# Altium schematic sheet main.SchDoc
size A3
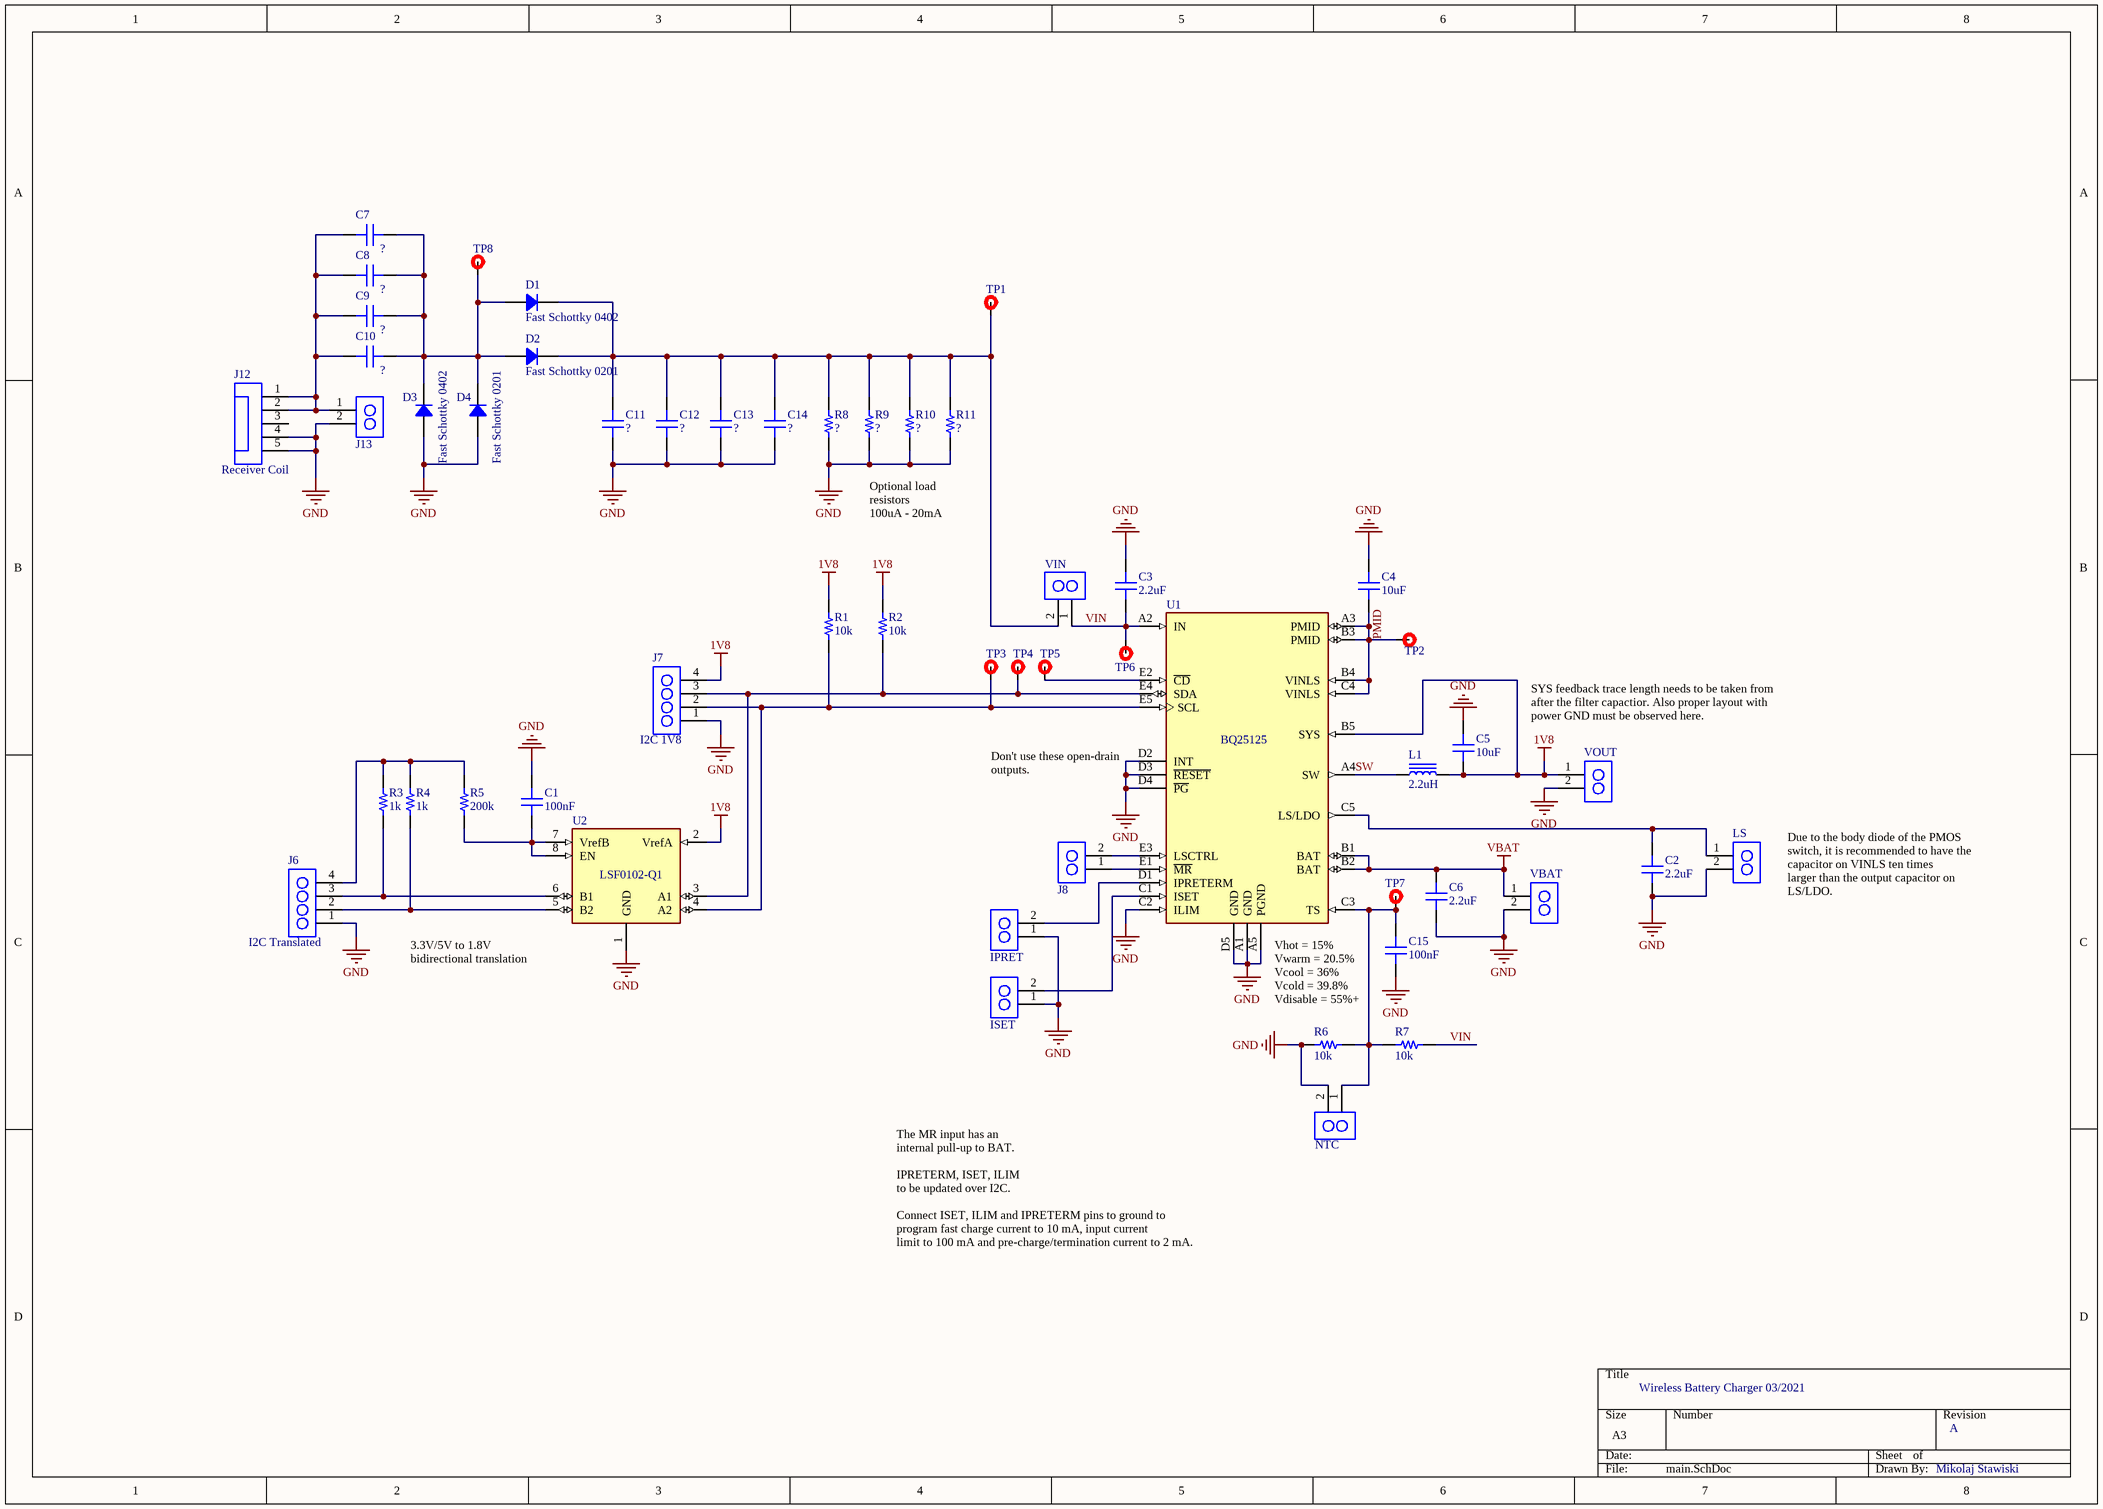
[diagram p0: main.SchDoc]

## Parts
C1  100nF  [SMD_CAPACITOR_0603]
C2  2.2uF  [SMD_CAPACITOR_0402]
C3  2.2uF  [SMD_CAPACITOR_0402]
C4  10uF  [SMD_CAPACITOR_0402]
C5  10uF  [SMD_CAPACITOR_0402]
C6  2.2uF  [SMD_CAPACITOR_0402]
C7  ?  [SMD_CAPACITOR_0402]
C8  ?  [SMD_CAPACITOR_0402]
C9  ?  [SMD_CAPACITOR_0402]
C10  ?  [SMD_CAPACITOR_0402]
C11  ?  [SMD_CAPACITOR_0402]
C12  ?  [SMD_CAPACITOR_0402]
C13  ?  [SMD_CAPACITOR_0402]
C14  ?  [SMD_CAPACITOR_0402]
C15  100nF  [SMD_CAPACITOR_0201]
D1  Fast Schottky 0402  [CLP1006-2L]
D2  Fast Schottky 0201  [CLP0603-2M]
D3  Fast Schottky 0402  [CLP1006-2L]
D4  Fast Schottky 0201  [CLP0603-2M]
IPRET  *  [HEADER_2PIN_0022272021]  (value not drawn)
ISET  *  [HEADER_2PIN_0022272021]  (value not drawn)
J6  I2C Translated  [HEADER_4PIN_0022272041]
J7  I2C 1V8  [HEADER_4PIN_0022272041]
J8  *  [HEADER_2PIN_0022272021]  (value not drawn)
J12  Receiver Coil  [FPC_5PIN_0545500571]
J13  *  [HEADER_2PIN_0022272021]  (value not drawn)
L1  2.2uH  [SMD_INDUCTOR_0603]
LS  LOAD SWITCH  [HEADER_2PIN_0022272021]  (value not drawn)
NTC  NTC  [HEADER_2PIN_0022272021]  (value not drawn)
R1  10k  [SMD_RESISTOR_0603]
R2  10k  [SMD_RESISTOR_0603]
R3  1k  [SMD_RESISTOR_0603]
R4  1k  [SMD_RESISTOR_0603]
R5  200k  [SMD_RESISTOR_0603]
R6  10k  [SMD_RESISTOR_0603]
R7  10k  [SMD_RESISTOR_0603]
R8  ?  [SMD_RESISTOR_0603]
R9  ?  [SMD_RESISTOR_0603]
R10  ?  [SMD_RESISTOR_0402]
R11  ?  [SMD_RESISTOR_0402]
TP1  Testpoint  [Testpoint 2mm]  (value not drawn)
TP2  Testpoint  [Testpoint 2mm]  (value not drawn)
TP3  Testpoint  [Testpoint 2mm]  (value not drawn)
TP4  Testpoint  [Testpoint 2mm]  (value not drawn)
TP5  Testpoint  [Testpoint 2mm]  (value not drawn)
TP6  Testpoint  [Testpoint 2mm]  (value not drawn)
TP7  Testpoint  [Testpoint 2mm]  (value not drawn)
TP8  Testpoint  [Testpoint 2mm]  (value not drawn)
U1  BQ25125  [BQ25125-DSBGA25]
U2  LSF0102-Q1  [8-VSSOP]
VBAT  BATTERY  [HEADER_2PIN_0022272021]  (value not drawn)
VIN  *  [HEADER_2PIN_0022272021]  (value not drawn)
VOUT  OUT  [HEADER_2PIN_0022272021]  (value not drawn)

## Nets
1V8: C5.1 J7.4 L1.2 R1.2 R2.2 U1.B5(SYS) U2.2(VrefA) VOUT.1
GND: C1.2 C2.1 C3.2 C4.2 C5.2 C6.1 C11.1 C12.1 C13.1 C14.1 C15.1 D3.1 D4.1 IPRET.1 ISET.1 J6.1 J7.1 J12.4 J12.5 J13.2 LS.2 NTC.2 R6.2 R8.1 R9.1 R10.1 R11.1 U1.A1(GND) U1.A5(PGND) U1.C2(ILIM) U1.D2(INT) U1.D3(~{RESET}) U1.D4(~{PG}) U1.D5(GND) U2.1(GND) VBAT.2 VOUT.2
VBAT: C6.2 U1.B1(BAT) U1.B2(BAT) VBAT.1
PMID: C4.1 TP2.1 U1.A3(PMID) U1.B3(PMID) U1.B4(VINLS) U1.C4(VINLS)
SW: L1.1 U1.A4(SW)
VIN: C3.1 R7.1 TP6.1 U1.A2(IN) VIN.1
NetC1_1: C1.1 R5.1 U2.7(VrefB) U2.8(EN)
NetC2_2: C2.2 LS.1 U1.C5(LS/LDO)
NetC7_1: C7.1 C8.1 C9.1 C10.1 D1.1 D2.1 D3.2 D4.2 TP8.1
NetC7_2: C7.2 C8.2 C9.2 C10.2 J12.1 J12.2 J13.1
NetC11_2: C11.2 C12.2 C13.2 C14.2 D1.2 D2.2 R8.2 R9.2 R10.2 R11.2 TP1.1 VIN.2
NetC15_2: C15.2 NTC.1 R6.1 R7.2 TP7.1 U1.C3(TS)
NetIPRET_2: IPRET.2 U1.D1(IPRETERM)
NetISET_2: ISET.2 U1.C1(ISET)
NetJ6_2: J6.2 R4.1 U2.5(B2)
NetJ6_3: J6.3 R3.1 U2.6(B1)
NetJ6_4: J6.4 R3.2 R4.2 R5.2
NetJ7_2: J7.2 R1.1 TP3.1 U1.E5(SCL) U2.4(A2)
NetJ7_3: J7.3 R2.1 TP4.1 U1.E4(SDA) U2.3(A1)
NetJ8_1: J8.1 U1.E1(~{MR})
NetJ8_2: J8.2 U1.E3(LSCTRL)
NetTP5_1: TP5.1 U1.E2(~{CD})

Not connected (* = marked no-connect by the designer): J12 3

## Notes on the sheet
- Optional load resistors
  100uA - 20mA
- SYS feedback trace length needs to be taken from after the filter capactior. Also proper layout with power GND must be observed here.
- (near U1) Don't use these open-drain outputs.
- Due to the body diode of the PMOS switch, it is recommended to have the capacitor on VINLS ten times
  larger than the output capacitor on LS/LDO.
- (near U2) 3.3V/5V to 1.8V bidirectional translation
- (near U1) Vhot = 15%
  Vwarm = 20.5%
  Vcool = 36%
  Vcold = 39.8%
  Vdisable = 55%+
- IPRETERM, ISET, ILIM to be updated over I2C.
- The MR input has an internal pull-up to BAT.
- Connect ISET, ILIM and IPRETERM pins to ground to program fast charge current to 10 mA, input current
  limit to 100 mA and pre-charge/termination current to 2 mA.
- Wireless Battery Charger 03/2021
- A
- Mikolaj Stawiski

## Library data of the parts
C1 = CAPACITOR_0603: Capacitor SMT 0603; Part Number: *; Value: 100nF; Device Package: 0603 (1608 Metric); Manufacturer: *; Mounting Type: SMT; Operating Temperature: *; Size / Dimension: 0.063" L x 0.031" W (1.60mm x 0.80mm); Thickness (Max): *; Tolerance: *; Voltage - Rated: *; Distributor link 1: *; Distributor link 2: *; Distributor link 3: *
C2 C3 C6 = CAPACITOR_0402: Ceramic Capacitor 2.2uF 20% 6.3V X5R 0402; Part Number: GRM155R60J225ME15D; Manufacturer: Murata; Value: 2.2uF; Device Package: 0402 (1005 Metric); Mounting Type: SMT; Operating Temperature: *; Size / Dimension: 0.039" L x 0.020" W (1.00mm x 0.50mm); Thickness (Max): *; Tolerance: 20%; Voltage - Rated: 6.3V; Distributor link 1: https://www.digikey.com.au/product-detail/en/murata-electronics/GRM155R60J225ME15D/490-4519-1-ND/1033278; Distributor link 2: *; Distributor link 3: *
C4 C5 = CAPACITOR_0402: Ceramic Capacitor 10uF 20% 10V X5R 0402; Part Number: CL05A106MP5NUNC; Manufacturer: Samsung; Value: 10uF; Device Package: 0402 (1005 Metric); Mounting Type: SMT; Operating Temperature: *; Size / Dimension: 0.039" L x 0.020" W (1.00mm x 0.50mm); Thickness (Max): *; Tolerance: 20%; Voltage - Rated: 10V; Distributor link 1: https://www.digikey.com/en/products/detail/samsung-electro-mechanics/CL05A106MP5NUNC/3887108?s=N4IgTCBcDaIMIBkAMBWAggRiQNgLIAUUA5AVSLhAF0BfIA; Distributor link 2: *; Distributor link 3: *
C7-C14 = CAPACITOR_0402: Ceramic Capacitor 10V X5R 0402; Part Number: ?; Value: ?; Device Package: 0402 (1005 Metric); Manufacturer: ?; Mounting Type: SMT; Operating Temperature: *; Size / Dimension: 0.039" L x 0.020" W (1.00mm x 0.50mm); Thickness (Max): *; Tolerance: *; Voltage - Rated: 10V; Distributor link 1: *; Distributor link 2: *; Distributor link 3: *
C15 = CAPACITOR_0201: Capacitor SMT 0201; Part Number: *; Value: 100nF; Device Package: 0201 (0603 Metric); Manufacturer: *; Mounting Type: SMT; Operating Temperature: *; Size / Dimension: 0.024" L x 0.012" W (0.60mm x 0.30mm); Thickness (Max): *; Tolerance: *; Voltage - Rated: *; Distributor link 1: *; Distributor link 2: *; Distributor link 3: *
D1 D3 = DIODE_0402: Diode SMT 0402; Part Number: VSKY05301006; Manufacturer: Vishay; Value: Fast Schottky 0402; Device Package: 0402 (1005 Metric); Mounting Type: SMT; Operating Temperature: *; Size / Dimension: 0.039" L x 0.020" W (1.00mm x 0.50mm); Thickness (Max): *; Tolerance: *; Voltage - Rated: *; Distributor link 1: https://www.digikey.com/en/products/detail/vishay-general-semiconductor-diodes-division/VSKY05301006-G4-08/7390852; Distributor link 2: *; Distributor link 3: *
D2 D4 = DIODE_0201: Diode SMT 0201; Part Number: VSKY02300603; Manufacturer: Vishay; Value: Fast Schottky 0201; Device Package: 0201 (0603 Metric); Mounting Type: SMT; Operating Temperature: *; Size / Dimension: 0.024" L x 0.012" W (0.60mm x 0.30mm); Thickness (Max): *; Tolerance: *; Voltage - Rated: *; Distributor link 1: https://www.digikey.com/en/products/detail/vishay-general-semiconductor-diodes-division/VSKY02300603-G4-08/7390849; Distributor link 2: *; Distributor link 3: *
IPRET ISET J8 J13 LS NTC VBAT VIN VOUT = CONN_2PIN: Connector 2-pin generic; Part Number: *; Value: *; Device Package: *; Manufacturer: *; Mounting Type: *; Operating Temperature: *; Size / Dimension: *; Thickness (Max): *; Voltage - Rated: *; Distributor link 1: *; Distributor link 2: *; Distributor link 3: *
J6 J7 = CONN_4PIN: Connector 4-pin generic; Part Number: *; Value: *; Device Package: *; Manufacturer: *; Mounting Type: *; Operating Temperature: *; Size / Dimension: *; Thickness (Max): *; Voltage - Rated: *; Distributor link 1: *; Distributor link 2: *; Distributor link 3: *
J12 = CONN_FPC_5PIN: FPC connector 5-pin generic; Part Number: *; Value: Receiver Coil; Device Package: *; Manufacturer: *; Mounting Type: *; Operating Temperature: *; Size / Dimension: *; Thickness (Max): *; Voltage - Rated: *; Distributor link 1: *; Distributor link 2: *; Distributor link 3: *
L1 = INDUCTOR_0603: Inductor fixed 2.2uH 20% 500mA 180mOhm 0603; Part Number: MLZ1608N2R2LT000; Manufacturer: TDK; Value: 2.2uH; Device Package: 0603 (1608 Metric); Mounting Type: SMT; Operating Temperature: *; Size / Dimension: 0.063" L x 0.031" W (1.60mm x 0.80mm); Thickness (Max): *; Tolerance: 20%; Voltage - Rated: *; Distributor link 1: https://www.digikey.com.au/product-detail/en/tdk-corporation/MLZ1608N2R2LT000/445-6754-1-ND/2523575; Distributor link 2: *; Distributor link 3: *
R1-R9 = RESISTOR_0603: Resistor SMT 0603; Part Number: *; Device Package: 0603 (1608 Metric); Manufacturer: *; Mounting Type: SMT; Operating Temperature: *; Size / Dimension: 0.063" L x 0.031" W (1.60mm x 0.80mm); Thickness (Max): *; Tolerance: *; Voltage - Rated: *; Distributor link 1: *; Distributor link 2: *; Distributor link 3: *
  R1 R2 R6 R7: Value: 10k
  R3 R4: Value: 1k
  R5: Value: 200k
  R8 R9: Value: ?
R10 R11 = RESISTOR_0402: Resistor SMT 0402; Part Number: *; Value: ?; Device Package: 0402 (1005 Metric); Manufacturer: *; Mounting Type: SMT; Operating Temperature: *; Size / Dimension: 0.039" L x 0.020" W (1.00mm x 0.50mm); Thickness (Max): *; Tolerance: *; Voltage - Rated: *; Distributor link 1: *; Distributor link 2: *; Distributor link 3: *
TP1-TP8 = Testpoint: Testpoint for measuring at the PCB
U1 = BQ25125: BQ25125 Low IQ Highly Integrated Battery Charge Management Solution For Wearables and IoT; Manufacturer: TI; Part Number: BQ25125; Value: BQ25125; Device Package: *; Mounting Type: SMT; Operating Temperature: *; Package / Case: *; Size / Dimension: *; Thickness (Max): *; Distributor link 1: https://www.digikey.com/en/products/detail/texas-instruments/BQ25125YFPR/10273214; Distributor link 2: *; Distributor link 3: *; Link: https://www.ti.com/product/BQ25125
U2 = LSF0102-Q1: Automotive 2-Channel Auto Bidirectional Multi-Voltage Level Translator; Part Number: LSF0102QDCURQ1; Manufacturer: TI; Value: LSF0102-Q1; Device Package: 8-VSSOP; Mounting Type: SMT; Operating Temperature: -40°C ~ 125°C; Package / Case: 8-VFSOP (0.091"", 2.30mm Width); Size / Dimension: *; Thickness (Max): *; Distributor link 1: https://www.digikey.com/en/products/detail/texas-instruments/LSF0102QDCURQ1/9343347?s=N4IgTCBcDaIDIGUBiAGAjCsBFAIgYQFUAlLNEAXQF8g; Distributor link 2: *; Distributor link 3: *; Link: https://www.ti.com/product/LSF0102-Q1